# EasyEDA Pro project 51.eprj

# Schematic Schematic1
Board Name: Board1; Create Date: 2025-02-16; Page Name: P1; Project Name: 51; Schematic Name: Schematic1; Update Date: 2025-02-23; Company: 嘉立创EDA; Page Size: A4; Version: V1.0
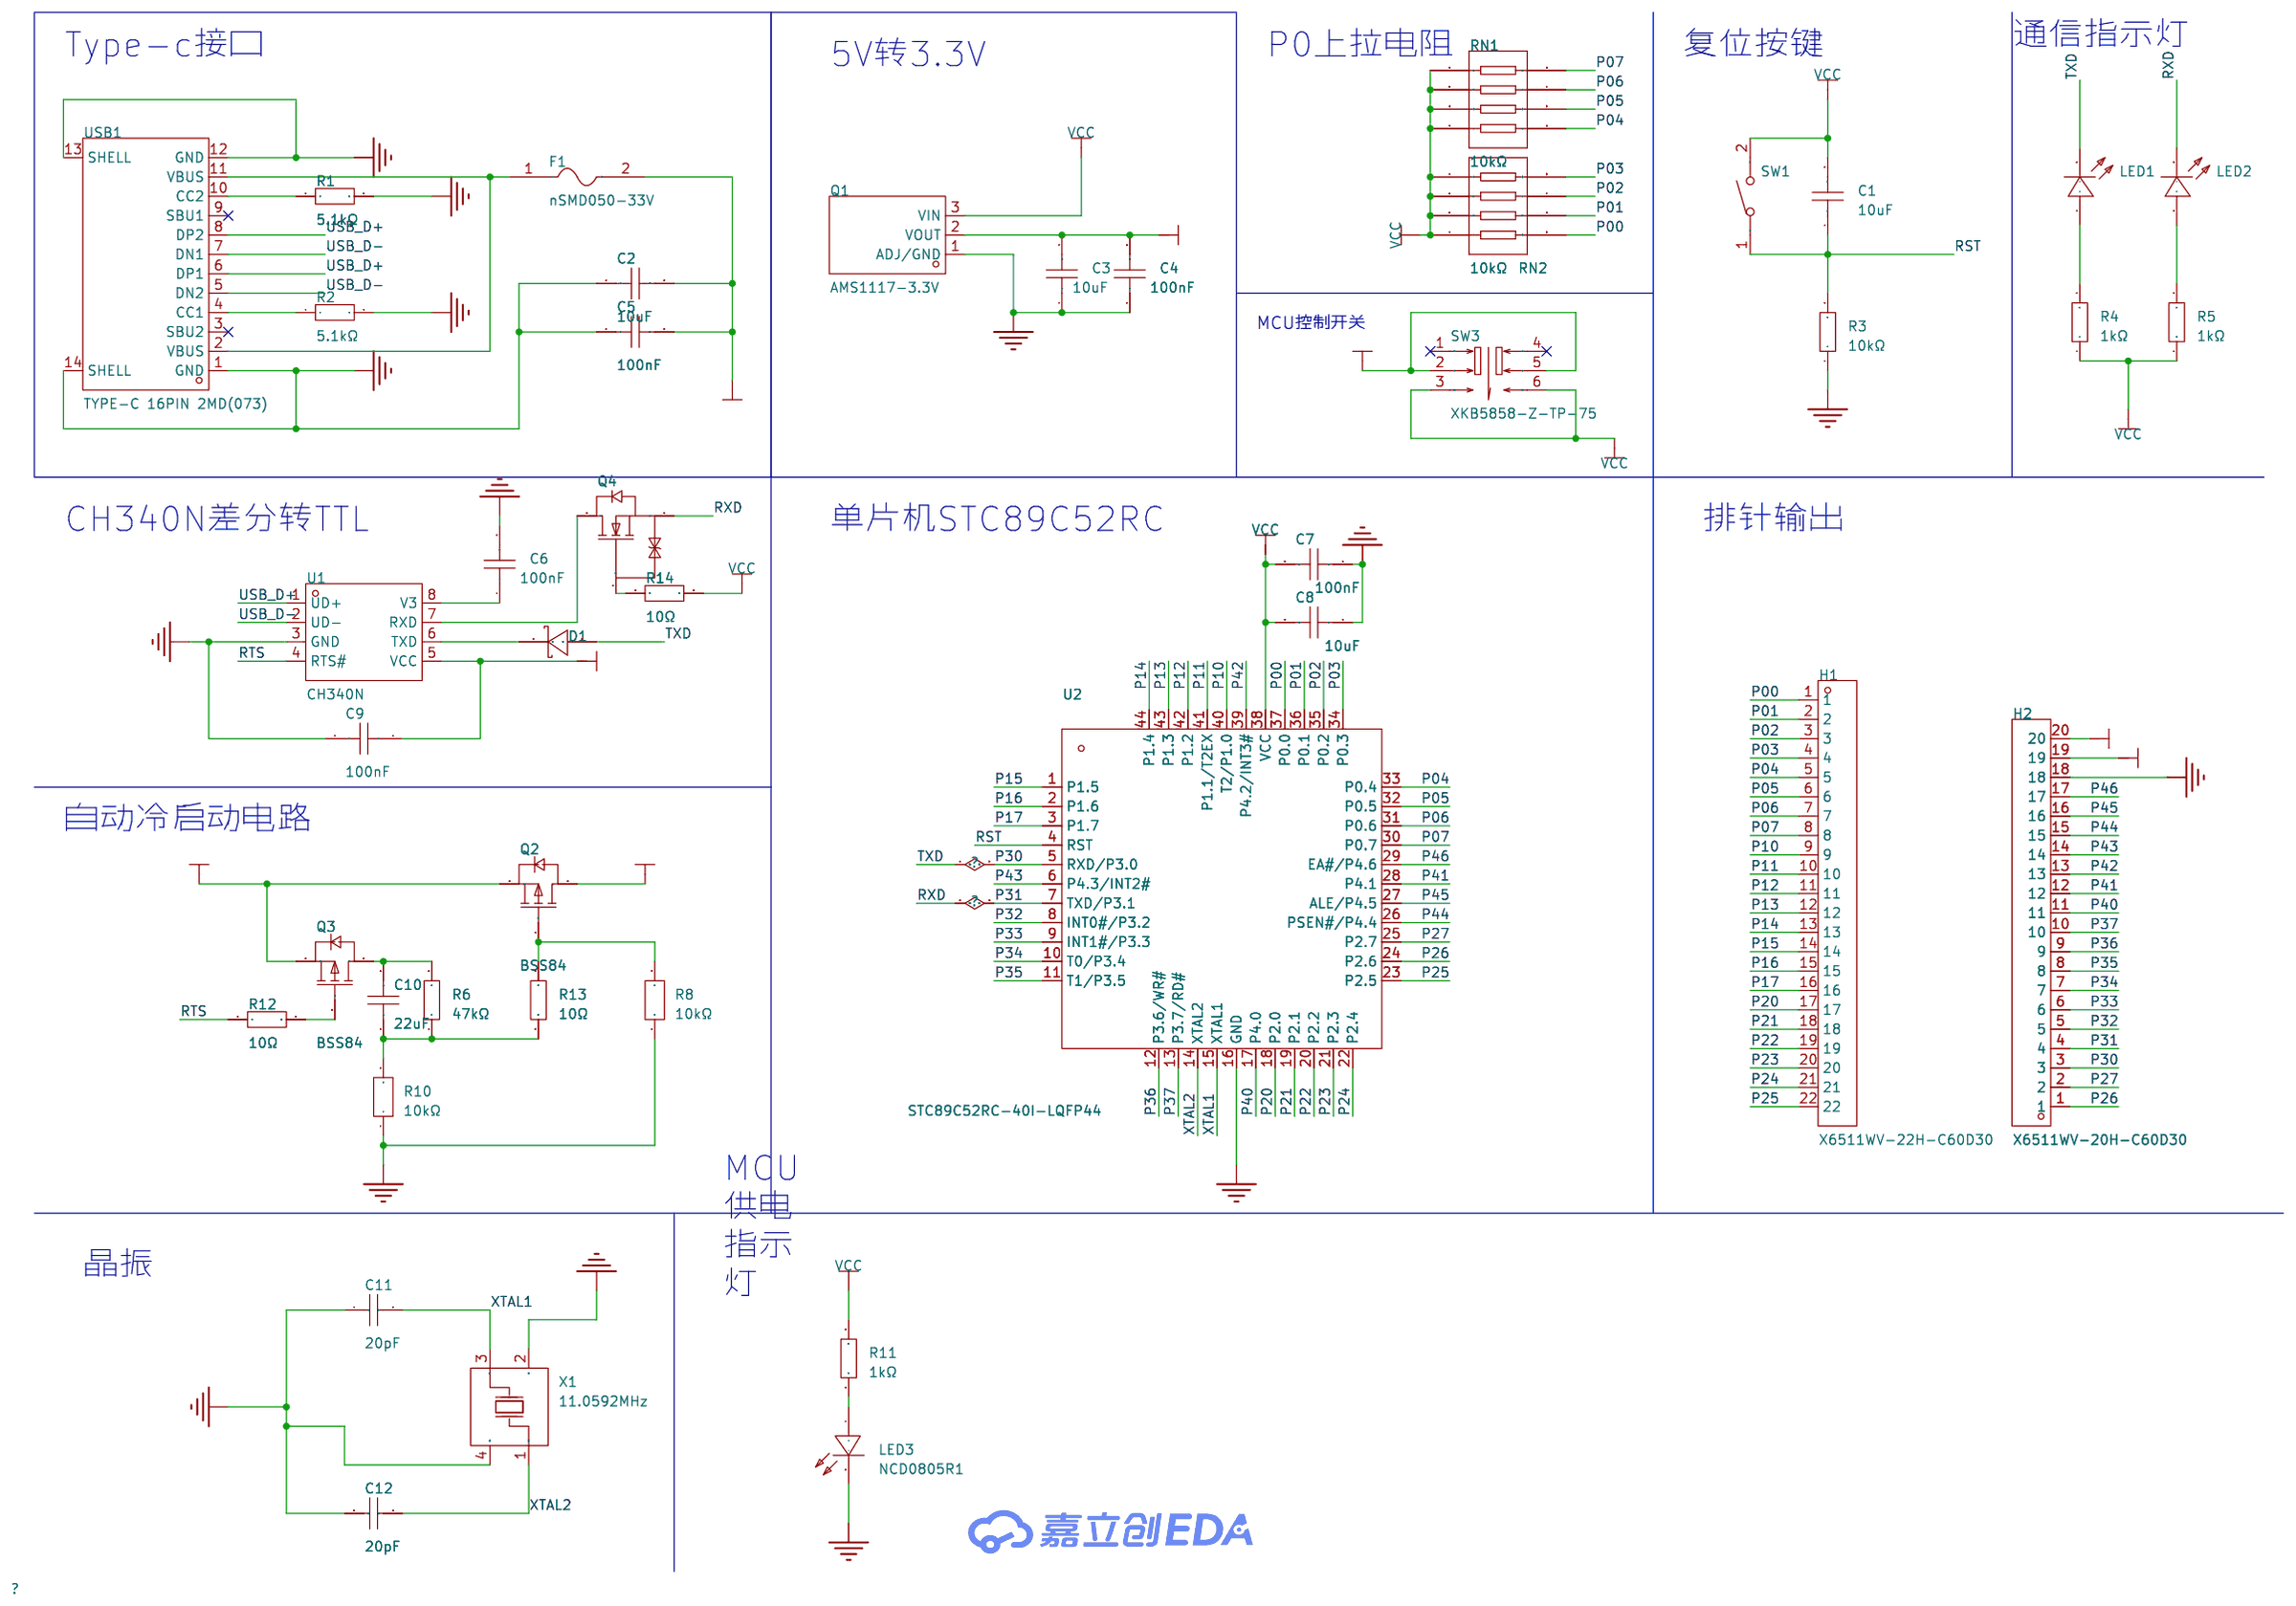
[diagram p0: schematic sheet]

## Parts
C1  10uF  [C0603]
C2  10uF  [C0603]
C3  10uF  [C0603]
C4  100nF  [C0603]
C5  100nF  [C0603]
C6  100nF  [C0603]
C7  100nF  [C0603]
C8  10uF  [C0603]
C9  100nF  [C0603]
C10  22uF  [C0603]
C11  20pF  [C0603]
C12  20pF  [C0603]
D1  B0520W  [SOD-123_L2.6-W1.7-LS3.5-RD]
F1  nSMD050-33V  [F1206]
H1  X6511WV-22H-C60D30  [HDR-TH_22P-P2.54-V-M]
H2  X6511WV-20H-C60D30  [HDR-TH_20P-P2.54-V-M]
LED1  NCD0805R1  [LED0805-R-RD]
LED2  NCD0805R1  [LED0805-R-RD]
LED3  NCD0805R1  [LED0805-R-RD]
Q1  AMS1117-3.3V  [SOT-89-3_L4.5-W2.5-P1.50-LS4.2-BR]
Q2  BSS84  [SOT-23-3_L2.9-W1.3-P1.90-LS2.4-BR-1]
Q3  BSS84  [SOT-23-3_L2.9-W1.3-P1.90-LS2.4-BR-1]
Q4  2SK3018  [SOT-23-3_L2.9-W1.4-P1.90-LS2.6-BR]
R1  5.1kΩ  [R0603]
R2  5.1kΩ  [R0603]
R3  10kΩ  [R0603]
R4  1kΩ  [R0603]
R5  1kΩ  [R0603]
R6  47kΩ  [R0603]
R8  10kΩ  [R0603]
R10  10kΩ  [R0603]
R11  1kΩ  [R0603]
R12  10Ω  [R0603]
R13  10Ω  [R0603]
R14  10Ω  [R0603]
RN1  10kΩ  [RES-ARRAY-SMD_0402-8P-L2.0-W1.0-BL]
RN2  10kΩ  [RES-ARRAY-SMD_0402-8P-L2.0-W1.0-BL]
SW1  TS-1088-AR02016  [SW-SMD_L3.9-W3.0-P4.45]
SW3  XKB5858-Z-TP-75  [SW-SMD_6P-L5.8-W5.8-P2.00-LS8.3]
U1  CH340N  [SOP-8_L4.9-W3.9-P1.27-LS6.0-BL]
U2  STC89C52RC-40I-LQFP44  [LQFP-44_L10.0-W10.0-P0.80-LS12.0-BL]
USB1  TYPE-C 16PIN 2MD(073)  [USB-C-SMD_TYPE-C-6PIN-2MD-073]
X1  11.0592MHz  [CRYSTAL-SMD_4P-L5.0-W3.2-BL]

## Library data of the parts
C1-C3 C8 = CGA0603X5R106K100JT: LCSC Part Name: 10uF ±10% 10V; Supplier Part: C6119842; Manufacturer: HRE(芯声); Supplier Footprint: 0603; JLCPCB Part Class: 扩展库; Supplier: LCSC; Tolerance: ±10%; Voltage Rated: 10V; Temperature Coefficient: X5R
C4-C7 C9 = CGA0603X7R104K500JT: LCSC Part Name: 100nF ±10% 50V; Supplier Part: C6119867; Manufacturer: HRE(芯声); Supplier Footprint: 0603; JLCPCB Part Class: 扩展库; Supplier: LCSC; Tolerance: ±10%; Voltage Rated: 50V; Temperature Coefficient: X7R
C10 = CGA0603X5R226M160JT: LCSC Part Name: 22uF ±20% 16V; Supplier Part: C6119868; Manufacturer: HRE(芯声); Supplier Footprint: 0603; JLCPCB Part Class: 扩展库; Supplier: LCSC; Tolerance: ±20%; Voltage Rated: 16V; Temperature Coefficient: X5R
C11 C12 = CL10C200JB8NNNC: LCSC Part Name: 20pF ±5% 50V; Supplier Part: C1648; Manufacturer: SAMSUNG(三星); Supplier Footprint: 0603; JLCPCB Part Class: 基础库; Datasheet: https://atta.szlcsc.com/upload/public/pdf/source/20160218/1457707763339.pdf; Supplier: LCSC; Tolerance: ±5%; Voltage Rated: 50V; Temperature Coefficient: C0G
D1 = B0520W_C5189256: LCSC Part Name: 电压:20V 电流:500mA; Supplier Part: C5189256; Manufacturer: TWGMC(台湾迪嘉); Supplier Footprint: SOD-123; JLCPCB Part Class: 扩展库; Datasheet: https://atta.szlcsc.com/upload/public/pdf/source/20221012/F0D1432D6590E003997B40C6325B554B.pdf; Supplier: LCSC; Diode Configuration: 独立式; Forward Voltage (Vf@If): 430mV@500mA; Reverse Voltage (Vr): 20V; Rectified Current: 500mA; Reverse Leakage Current (Ir): 250uA
F1 = nSMD050-33V: LCSC Part Name: 0.50A  33V 自恢复保险丝; Supplier Part: C70077; Manufacturer: 台湾陆海; Supplier Footprint: 1206; JLCPCB Part Class: 扩展库; Datasheet: https://atta.szlcsc.com/upload/public/pdf/source/20180608/C70077_B8D50CC58F6AC16481F48F7D0521DF66.pdf; Supplier: LCSC; Operating Voltage (Max): 33V; Current Rating (Max): 100A; Hold Current: 500mA; Trip Current: 1A
H1 = X6511WV-22H-C60D30: LCSC Part Name: 1x22P 间距:2.54mm 方针; Supplier Part: C725954; Manufacturer: XKB Connection(中国星坤); Supplier Footprint: 插件,P=2.54mm; JLCPCB Part Class: 扩展库; Datasheet: https://atta.szlcsc.com/upload/public/pdf/source/20221108/2FDDF9C694C8EDC81165E23F2EAAE597.pdf; Supplier: LCSC; Pin Structure: 1x22P; Pitch: 2.54mm; Row Spacing: 2.54mm; Circluar Pins/Square Pins: 方针; Number of Rows: 单排; Number of Pins: 22P; Current Rating (Max): 3A; Voltage Rating (Max): 250V; Insulation Height: 2.5mm; Contact Material: 黄铜; Contact Plating: 金; Operating Temperature Range: -40℃~+105℃; Soldering Temperature(Max): 260℃; Color: 黑色
H2 = X6511WV-20H-C60D30: LCSC Part Name: 1x20P 间距:2.54mm 方针; Supplier Part: C725952; Manufacturer: XKB Connection(中国星坤); Supplier Footprint: 插件,P=2.54mm; JLCPCB Part Class: 扩展库; Datasheet: https://atta.szlcsc.com/upload/public/pdf/source/20221108/2FDDF9C694C8EDC81165E23F2EAAE597.pdf; Supplier: LCSC; Pin Structure: 1x20P; Pitch: 2.54mm; Row Spacing: 2.54mm; Circluar Pins/Square Pins: 方针; Number of Rows: 单排; Number of Pins: 20P; Current Rating (Max): 3A; Voltage Rating (Max): 250V; Insulation Height: 2.5mm; Contact Material: 黄铜; Contact Plating: 金; Operating Temperature Range: -40℃~+105℃; Soldering Temperature(Max): 260℃; Color: 黑色
LED1-LED3 = NCD0805R1: Supplier Part: C84256; Manufacturer: 国星光电; Supplier Footprint: 0805; JLCPCB Part Class: 基础库; Datasheet: https://atta.szlcsc.com/upload/public/pdf/source/20200820/C84256_F0A75A43B3EAD75808600A0514C76B99.pdf; Supplier: LCSC; Emitted Color: 红色; Forward Voltage (VF): 1.6V~2.6V; Power Dissipation: 65mW; Forward Current: 20mA; Dominant Wavelength: 615nm~630nm; Diode Configuration: 独立二极管; Lens Color: 无色透明透镜; Luminous Intensity: 67mcd~195mcd; Viewing Angle: 130°; Operating Temperature: -30℃~+85℃
Q1 = AMS1117-3.3V_C5120796: LCSC Part Name: 输入18V 输出3.3V 1A; Supplier Part: C5120796; Manufacturer: MSKSEMI(美森科); Supplier Footprint: SOT-89; JLCPCB Part Class: 扩展库; Datasheet: https://atta.szlcsc.com/upload/public/pdf/source/20220727/5E62EAC46FFFF83337622C0FBE1B6BF8.pdf; Supplier: LCSC; Output Type: 固定; Maximum Input Voltage: 18V; Output Voltage: 3.3V; MAX Output Current: 1A; Dropout Voltage: 1.4V@(1A); standby current: 12mA; Operating Temperature: 0℃~+125℃; Output Polarity: 正极; Number of Outputs: 1
Q2 Q3 = BSS84_C7420340: LCSC Part Name: P沟道,电流:-0.17A,耐压:-60V; Supplier Part: C7420340; Manufacturer: 宏迦橙; Supplier Footprint: SOT-23; JLCPCB Part Class: 扩展库; Datasheet: https://atta.szlcsc.com/upload/public/pdf/source/20230630/CFCF3EFF80655E4500DCC7BD4B2736C9.pdf; Supplier: LCSC; Type: 1个P沟道; Drain Source Voltage (Vdss): 60V; Continuous Drain Current (Id): 170mA; Drain Source On Resistance (RDS(on)@Vgs,Id): 8Ω@10V,0.17A; Power Dissipation (Pd): 225mW; Gate Threshold Voltage (Vgs(th)@Id): 900mV@250uA; Total Gate Charge (Qg@Vgs): 1.77nC@10V; Input Capacitance (Ciss@Vds): 43pF; Reverse Transfer Capacitance (Crss@Vds): 2.8pF; Operating Temperature: -55℃~+150℃
Q4 = 2SK3018: LCSC Part Name: 1个N沟道 耐压:30V 电流:100mA; Supplier Part: C727148; Manufacturer: TWGMC(台湾迪嘉); Supplier Footprint: SOT-23; JLCPCB Part Class: 扩展库; Datasheet: https://atta.szlcsc.com/upload/public/pdf/source/20200827/C727148_2301BBDB89FCE642A4A39ABEF7075607.pdf; Supplier: LCSC; Type: 1个N沟道; Drain Source Voltage (Vdss): 30V; Continuous Drain Current (Id): 100mA; Drain Source On Resistance (RDS(on)@Vgs,Id): 13Ω@2.5V,1mA; Power Dissipation (Pd): 350mW; Gate Threshold Voltage (Vgs(th)@Id): 800mV@100uA; Input Capacitance (Ciss@Vds): 13pF; Reverse Transfer Capacitance (Crss@Vds): 4pF; Operating Temperature: -55℃~+150℃
R1 R2 = 0603WAF5101T5E: LCSC Part Name: 5.1kΩ ±1% 100mW 厚膜电阻; Supplier Part: C23186; Manufacturer: UNI-ROYAL(厚声); Supplier Footprint: 0603; JLCPCB Part Class: 基础库; Datasheet: https://atta.szlcsc.com/upload/public/pdf/source/20200306/C422600_1E6D84923E4A46A82E41ADD87F860B5C.pdf; Supplier: LCSC; Type: 厚膜电阻; Tolerance: ±1%; Power(Watts): 100mW; Overload Voltage (Max): 75V; Temperature Coefficient: ±100ppm/℃; Operating Temperature Range: -55℃~+155℃
R3 = 0603WAF1002T5E: LCSC Part Name: 厚膜电阻 10kΩ ±1% 100mW; Supplier Part: C25804; Manufacturer: UNI-ROYAL(厚声); Supplier Footprint: 0603; JLCPCB Part Class: 基础库; Datasheet: https://atta.szlcsc.com/upload/public/pdf/source/20200306/C422600_1E6D84923E4A46A82E41ADD87F860B5C.pdf; Supplier: LCSC; Type: 厚膜电阻; Tolerance: ±1%; Power(Watts): 100mW; Overload Voltage (Max): 75V; Temperature Coefficient: ±100ppm/℃; Operating Temperature Range: -55℃~+155℃
R4 R5 R11 = 0603WAF1001T5E: LCSC Part Name: 1kΩ ±1% 100mW 厚膜电阻; Supplier Part: C21190; Manufacturer: UNI-ROYAL(厚声); Supplier Footprint: 0603; JLCPCB Part Class: 基础库; Datasheet: https://atta.szlcsc.com/upload/public/pdf/source/20200306/C422600_1E6D84923E4A46A82E41ADD87F860B5C.pdf; Supplier: LCSC; Type: 厚膜电阻; Tolerance: ±1%; Power(Watts): 100mW; Overload Voltage (Max): 75V; Temperature Coefficient: ±100ppm/℃; Operating Temperature Range: -55℃~+155℃
R6 = 0603WAF4702T5E: LCSC Part Name: 47kΩ ±1% 100mW 厚膜电阻; Supplier Part: C25819; Manufacturer: UNI-ROYAL(厚声); Supplier Footprint: 0603; JLCPCB Part Class: 基础库; Datasheet: https://atta.szlcsc.com/upload/public/pdf/source/20200306/C422600_1E6D84923E4A46A82E41ADD87F860B5C.pdf; Supplier: LCSC; Type: 厚膜电阻; Tolerance: ±1%; Power(Watts): 100mW; Overload Voltage (Max): 75V; Temperature Coefficient: ±100ppm/℃; Operating Temperature Range: -55℃~+155℃
R8 R10 = FRC0603J103TS: LCSC Part Name: 10kΩ ±5% 100mW 厚膜电阻; Supplier Part: C2930027; Manufacturer: FOJAN(富捷); Supplier Footprint: 0603; JLCPCB Part Class: 扩展库; Datasheet: https://atta.szlcsc.com/upload/public/pdf/source/20211221/925EC7D7225764EE0046F22065062C87.pdf; Supplier: LCSC; Type: 厚膜电阻; Tolerance: ±5%; Power(Watts): 100mW; Overload Voltage (Max): 75V; Temperature Coefficient: ±100ppm/℃; Operating Temperature Range: -55℃~+155℃
R12-R14 = 0603WAF100JT5E: LCSC Part Name: 10Ω ±1% 100mW 厚膜电阻; Supplier Part: C22859; Manufacturer: UNI-ROYAL(厚声); Supplier Footprint: 0603; JLCPCB Part Class: 基础库; Datasheet: https://atta.szlcsc.com/upload/public/pdf/source/20200306/C422600_1E6D84923E4A46A82E41ADD87F860B5C.pdf; Supplier: LCSC; Type: 厚膜电阻; Tolerance: ±1%; Power(Watts): 100mW; Overload Voltage (Max): 75V; Temperature Coefficient: ±400ppm/℃; Operating Temperature Range: -55℃~+155℃
RN1 RN2 = 4D02WGJ0103TCE: LCSC Part Name: 10kΩ ±5%; Supplier Part: C25725; Manufacturer: UNI-ROYAL(厚声); Supplier Footprint: 0402x4; JLCPCB Part Class: 扩展库; Datasheet: https://atta.szlcsc.com/upload/public/pdf/source/20191224/C474318_2527498AE30E813171187CCD28401A71.pdf; Supplier: LCSC; Number of Resistors: 4; Tolerance: ±5%; Power(Watts): 62.5mW; Temperature Coefficient: ±200ppm/℃; Number of Pins: 8
SW1 = TS-1088-AR02016: LCSC Part Name: 4*3*2mm 立贴 轻触开关; Supplier Part: C720477; Manufacturer: XUNPU(讯普); Supplier Footprint: SMD; JLCPCB Part Class: 扩展库; Datasheet: https://atta.szlcsc.com/upload/public/pdf/source/20200810/C720475_60D09DD6C54279ADDB2DC25100F1CC11.pdf; Supplier: LCSC; Circuit: 单刀单掷; Actuator Style: 圆形按钮; Operating Force: 160gf; Mounting Style: 立贴; Switch Length: 4mm; Switch Width: 3mm; Switch Height: 2mm; Strike Gundam: 不带; Contact Current: 50mA; Voltage Rating (DC): 12V; Insulation Resistance: 100MΩ; Actuator/Cap Color: 黑色; Pin Style: SMD接片; Mechanical Life: 10万次; Operating Temperature: -30℃~+80℃
SW3 = XKB5858-Z-TP-75: LCSC Part Name: 按键开关5.8*按键开关5.8贴片自锁开关 平头; Supplier Part: C692487; Manufacturer: XKB Connectivity(中国星坤); Supplier Footprint: SMD; JLCPCB Part Class: 扩展库; Datasheet: https://atta.szlcsc.com/upload/public/pdf/source/20211011/C026329EEDA5FA5907D52CCCFB7A027C.pdf; Supplier: LCSC; Self Lock / No Lock: 自锁; Actuator Style: 方形按钮; Mounting Style: 立贴; Contact Current: 100mA; Voltage Rating (AC): 250V; Voltage Rating (DC): 30V; Insulation Resistance: 100MΩ; Actuator/Cap Color: 白色; With Lamp: 不带; Pin Style: SMD接片; Operating Force: 160gf; Operating Temperature: -15℃~+55℃; Mechanical Life: 10万次
U1 = CH340N: LCSC Part Name: USB转串口芯片CH340; Supplier Part: C2977777; Manufacturer: WCH(南京沁恒); Supplier Footprint: SOP-8; JLCPCB Part Class: 扩展库; Datasheet: https://atta.szlcsc.com/upload/public/pdf/source/20240313/115CDE92081B1D6CB446704AD5D0F5F2.pdf; Supplier: LCSC; Applications Function: USB转串口; Protocol: USB 2.0; Number of Channels: 1; Supply Voltage: 3.3V；5V; Data Rate: 2Mbps; Operating Temperature: -20℃~+70℃
U2 = STC89C52RC-40I-LQFP44: Supplier Part: C8707; Manufacturer: STC; Supplier Footprint: LQFP-44(10x10); JLCPCB Part Class: 扩展库; Datasheet: https://atta.szlcsc.com/upload/public/pdf/source/20241226/242305099CBBF4767F79975207B2F263.pdf; Supplier: LCSC; CPU Core: 51系列; Program Storage Size: 8KB; Program Memory Type: FLASH; Number of I/O: 39; Low Voltage Detection Threshold: 3.3V~5.5V
USB1 = TYPE-C 16PIN 2MD(073): LCSC Part Name: Type-C 母 卧贴; Supplier Part: C2765186; Manufacturer: SHOU HAN(首韩); Supplier Footprint: SMD; JLCPCB Part Class: 扩展库; Datasheet: https://atta.szlcsc.com/upload/public/pdf/source/20211123/39B17C16241EAC15C5E277BDA434118E.pdf; Supplier: LCSC; Connector Type: Type-C; Standard: USB 3.1; Gender: 母; Mounting Style: 卧贴; Number of Contacts: 16P; Number of Ports: 1; Current Rating - Power (Max): 5A; Operating Temperature Range: -25℃~+85℃; Rated Voltage (Max): 5V; Connect-Disconnect Life: 5千次; Core Colour: 黑色
X1 = TXM11.059M0004503LDCDO00T: LCSC Part Name: 11.0592MHz ±20ppm 20pF; Supplier Part: C362357; Manufacturer: YJX(雅晶鑫); Supplier Footprint: SMD5032-4P; JLCPCB Part Class: 扩展库; Datasheet: https://atta.szlcsc.com/upload/public/pdf/source/20190124/C362357_79AA44C3BCE26F730BD469CF609EF204.pdf; Supplier: LCSC; Crystal Type: 贴片晶振; Normal temperature Frequency Tolerance: ±20ppm; External load capacitor: 20pF; Frequency Stability(Full temperature range): ±20ppm; Equivalent Series Resistance (ESR): 80Ω; Operating Temperature: -40℃~+85℃

## Nets
3V3: C3.2 C4.2 H2.19 Q1.2(VOUT)
GND: C2.1 C3.1 C4.1 C5.1 C6.2 C7.1 C8.1 C9.2 C11.1 C12.1 H2.18 LED3.2(-) Q1.1(ADJ/GND) R1.2 R2.2 R3.1 R8.1 R10.1 U1.3(GND) U2.16(GND) USB1.1(GND) USB1.12(GND) USB1.13(SHELL) USB1.14(SHELL) X1.2(GND) X1.4(GND)
VCC: C1.2 C7.2 C8.2 H2.20 Q1.3(VIN) R4.1 R5.1 R11.2 R14.2 RN1.1 RN1.2 RN1.3 RN1.4 RN2.1 RN2.2 RN2.3 RN2.4 SW1.2 SW3.3 SW3.6 U2.38(VCC)
VCC_SW: Q2.3(D) SW3.2 SW3.5
VIN_5V: C2.2 C5.2 C9.1 F1.2 Q2.2(S) Q3.2(S) U1.5(VCC)
P00: H1.1 RN2.5 U2.37(P0.0)
P01: H1.2 RN2.6 U2.36(P0.1)
P02: H1.3 RN2.7 U2.35(P0.2)
P03: H1.4 RN2.8 U2.34(P0.3)
P04: H1.5 RN1.5 U2.33(P0.4)
P05: H1.6 RN1.6 U2.32(P0.5)
P06: H1.7 RN1.7 U2.31(P0.6)
P07: H1.8 RN1.8 U2.30(P0.7)
P10: H1.9 U2.40(T2/P1.0)
P11: H1.10 U2.41(P1.1/T2EX)
P12: H1.11 U2.42(P1.2)
P13: H1.12 U2.43(P1.3)
P14: H1.13 U2.44(P1.4)
P15: H1.14 U2.1(P1.5)
P16: H1.15 U2.2(P1.6)
P17: H1.16 U2.3(P1.7)
P20: H1.17 U2.18(P2.0)
P21: H1.18 U2.19(P2.1)
P22: H1.19 U2.20(P2.2)
P23: H1.20 U2.21(P2.3)
P24: H1.21 U2.22(P2.4)
P25: H1.22 U2.23(P2.5)
P26: H2.1 U2.24(P2.6)
P27: H2.2 U2.25(P2.7)
P30: D1.2 H2.3 LED1.2(-) U2.5(RXD/P3.0)
P31: H2.4 LED2.2(-) Q4.2(S) U2.7(TXD/P3.1)
P32: H2.5 U2.8(INT0#/P3.2)
P33: H2.6 U2.9(INT1#/P3.3)
P34: H2.7 U2.10(T0/P3.4)
P35: H2.8 U2.11(T1/P3.5)
P36: H2.9 U2.12(P3.6/WR#)
P37: H2.10 U2.13(P3.7/RD#)
P40: H2.11 U2.17(P4.0)
P41: H2.12 U2.28(P4.1)
P42: H2.13 U2.39(P4.2/INT3#)
P43: H2.14 U2.6(P4.3/INT2#)
P44: H2.15 U2.26(PSEN#/P4.4)
P45: H2.16 U2.27(ALE/P4.5)
P46: H2.17 U2.29(EA#/P4.6)
RST: C1.1 R3.2 SW1.1 U2.4(RST)
RTS: R12.1 U1.4(RTS#)
USB_D+: U1.1(UD+) USB1.6(DP1) USB1.8(DP2)
USB_D-: U1.2(UD-) USB1.5(DN2) USB1.7(DN1)
XTAL1: C11.2 U2.15(XTAL1) X1.3(OSC2)
XTAL2: C12.2 U2.14(XTAL2) X1.1(OSC1)
$1N493: R1.1 USB1.10(CC2)
$1N513: R2.1 USB1.4(CC1)
$1N622: F1.1 USB1.2(VBUS) USB1.11(VBUS)
$1N5316: LED3.1(+) R11.1
$1N5569: C6.1 U1.8(V3)
$1N5583: Q4.3(D) U1.7(RXD)
$1N5587: D1.1 U1.6(TXD)
$1N5943: LED1.1(+) R4.2
$1N5953: LED2.1(+) R5.2
$1N7938: Q3.1(G) R12.2
$1N8027: C10.2 Q3.3(D) R6.2
$1N8039: C10.1 R6.1 R10.2 R13.1
$1N8088: Q2.1(G) R8.2 R13.2
$1N12588: Q4.1(G) R14.1

Not connected (* = marked no-connect by the designer): SW3 1* 4*; USB1 3(SBU2)* 9(SBU1)*

## Notes on the sheet
- Type-c接口
- P0上拉电阻
- 复位按键
- 通信指示灯
- 5V转3.3V
- MCU控制开关
- CH340N差分转TTL
- 单片机STC89C52RC
- 排针输出
- 自动冷启动电路
- 晶振
- MCU
  供电
  指示
  灯

# Board PCB1
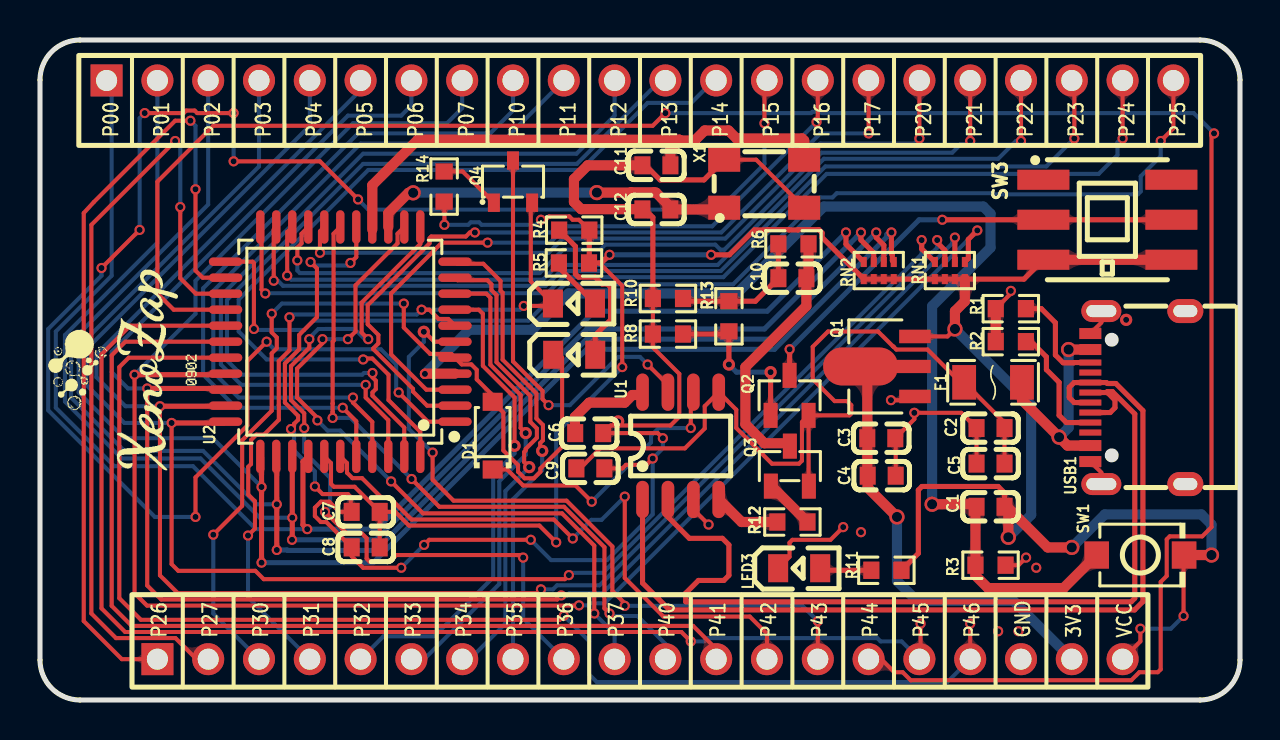
[diagram p1: board, top side]
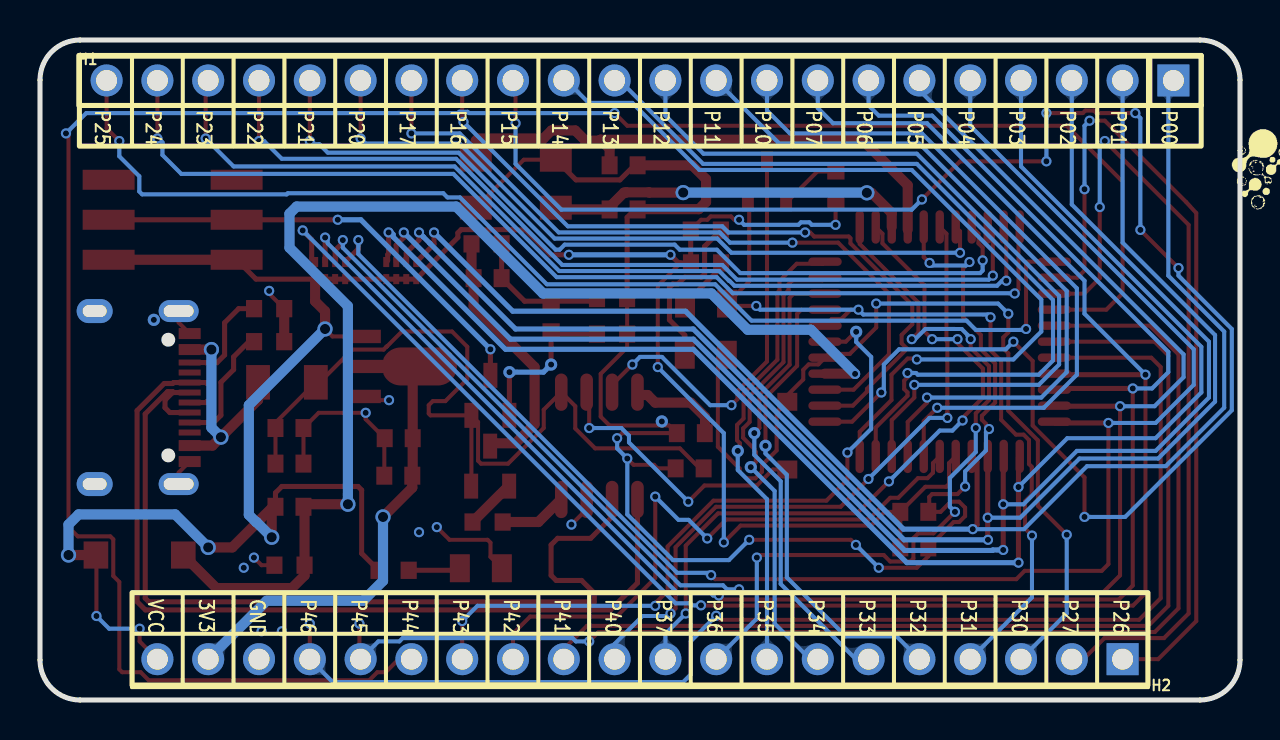
[diagram p2: board, bottom side, seen from below]

Outline 60 x 33 mm; copper layers: Top Layer, Bottom Layer. Coordinates in mm from the lower left corner of the outline.
Outline path: 0,31 0,2 arc(0.59,0.59) 2,0 58,0 arc(59.41,0.59) 60,2 60,31 arc(59.41,32.41) 58,33 2,33 arc(0.59,32.41) 0,31
Stack: Top Layer 0.035mm / Dielectric1 1.51mm FR4 er 4.5 / Bottom Layer 0.035mm

## Design rules (mm)
net USB_D+: DP1
net USB_D-: DP1
template: 自定义配置
spacing copperThickness1oz (default): track to track 0.102, other pairs 0.152 to 0.3
spacing copperThickness2oz: track to track 0.203, other pairs 0.152 to 0.3
track width copperThickness1oz (default): min 0.127, default 0.254, max 2.54
track width copperThickness2oz: min 0.203, default 0.254, max 2.54
differential pair differentialPair (default): width min 0.127, default 0.254, max 2.54; gap min 0.152, default 0.152
via viaSize (default): diameter min 0.5, default 0.61, max 10; hole min 0.3, default 0.305, max 6.3

## Placement (name value [footprint] x y rotation side)
C1  10uF  [C0603]  47.53 9.66 0 top
C2  10uF  [C0603]  47.53 13.6 0 top
C3  10uF  [C0603]  42.06 13.09 180 top
C4  100nF  [C0603]  42.08 11.22 180 top
C5  100nF  [C0603]  47.53 11.82 0 top
C6  100nF  [C0603]  27.46 13.34 0 top
C7  100nF  [C0603]  16.28 9.41 0 top
C8  10uF  [C0603]  16.28 7.63 0 top
C9  100nF  [C0603]  27.52 11.58 0 top
C10  22uF  [C0603]  37.62 21.09 0 top
C11  20pF  [C0603]  30.82 26.73 0 top
C12  20pF  [C0603]  30.82 24.53 0 top
D1  B0520W  [SOD-123_L2.6-W1.7-LS3.5-RD]  22.63 13.22 90 top
F1  nSMD050-33V  [F1206]  47.65 15.88 180 top
H1  X6511WV-22H-C60D30  [HDR-TH_22P-P2.54-V-M]  30 30.98 0 bottom
H2  X6511WV-20H-C60D30  [HDR-TH_20P-P2.54-V-M]  30 2.04 0 bottom
LED1  NCD0805R1  [LED0805-R-RD]  26.71 17.26 0 top
LED2  NCD0805R1  [LED0805-R-RD]  26.7 19.82 0 top
LED3  NCD0805R1  [LED0805-R-RD]  37.96 6.59 0 top
Q1  AMS1117-3.3V  [SOT-89-3_L4.5-W2.5-P1.50-LS4.2-BR]  42.39 16.68 0 top
Q2  BSS84  [SOT-23-3_L2.9-W1.3-P1.90-LS2.4-BR-1]  37.48 15.23 270 top
Q3  BSS84  [SOT-23-3_L2.9-W1.3-P1.90-LS2.4-BR-1]  37.49 11.69 270 top
Q4  2SK3018  [SOT-23-3_L2.9-W1.4-P1.90-LS2.6-BR]  23.65 25.92 270 top
R1  5.1kΩ  [R0603]  48.54 19.57 180 top
R2  5.1kΩ  [R0603]  48.54 17.92 180 top
R3  10kΩ  [R0603]  47.53 6.74 180 top
R4  1kΩ  [R0603]  26.71 23.49 180 top
R5  1kΩ  [R0603]  26.7 21.85 180 top
R6  47kΩ  [R0603]  37.67 22.81 0 top
R8  10kΩ  [R0603]  31.4 18.3 0 top
R10  10kΩ  [R0603]  31.4 20.08 0 top
R11  1kΩ  [R0603]  42.32 6.49 0 top
R12  10Ω  [R0603]  37.62 8.9 0 top
R13  10Ω  [R0603]  34.44 19.19 270 top
R14  10Ω  [R0603]  20.21 25.67 270 top
RN1  10kΩ  [RES-ARRAY-SMD_0402-8P-L2.0-W1.0-BL]  45.49 21.47 180 top
RN2  10kΩ  [RES-ARRAY-SMD_0402-8P-L2.0-W1.0-BL]  41.94 21.47 180 top
SW1  TS-1088-AR02016  [SW-SMD_L3.9-W3.0-P4.45]  55.02 7.25 0 top
SW3  XKB5858-Z-TP-75  [SW-SMD_6P-L5.8-W5.8-P2.00-LS8.3]  53.37 24.01 0 top
U1  CH340N  [SOP-8_L4.9-W3.9-P1.27-LS6.0-BL]  32.03 12.71 0 top
U2  STC89C52RC-40I-LQFP44  [LQFP-44_L10.0-W10.0-P0.80-LS12.0-BL]  15.01 17.92 90 top
USB1  TYPE-C 16PIN 2MD(073)  [USB-C-SMD_TYPE-C-6PIN-2MD-073]  54.89 15.12 90 top
X1  11.0592MHz  [CRYSTAL-SMD_4P-L5.0-W3.2-BL]  36.21 25.81 0 top

## Footprints (pads in the part's own frame, mm; a bottom-side part is the same pattern mirrored in y, then rotated)
C0603
  rect 0.8x0.9 smd: 1(-0.7,0) 2(0.7,0)
CRYSTAL-SMD_4P-L5.0-W3.2-BL
  rect 1.6x1.2 smd: 1(-2,-1.2) 2(2,-1.2) 3(2,1.2) 4(-2,1.2)
F1206
  rect 1.19x1.728 smd: 1(-1.445,0) 2(1.445,0)
HDR-TH_20P-P2.54-V-M
  rect 1.6x1.6 hole 1.05: 1(-24.13,0)
  round 1.6 hole 1.05: 2(-21.59,0) 3(-19.05,0) 4(-16.51,0) 5(-13.97,0) 6(-11.43,0) 7(-8.89,0) 8(-6.35,0) 9(-3.81,0) 10(-1.27,0) 11(1.27,0) 12(3.81,0) 13(6.35,0) 14(8.89,0) 15(11.43,0) 16(13.97,0) 17(16.51,0) 18(19.05,0) 19(21.59,0) 20(24.13,0)
HDR-TH_22P-P2.54-V-M
  rect 1.6x1.6 hole 1.05: 1(-26.67,0)
  round 1.6 hole 1.05: 2(-24.13,0) 3(-21.59,0) 4(-19.05,0) 5(-16.51,0) 6(-13.97,0) 7(-11.43,0) 8(-8.89,0) 9(-6.35,0) 10(-3.81,0) 11(-1.27,0) 12(1.27,0) 13(3.81,0) 14(6.35,0) 15(8.89,0) 16(11.43,0) 17(13.97,0) 18(16.51,0) 19(19.05,0) 20(21.59,0) 21(24.13,0) 22(26.67,0)
LED0805-R-RD
  rect 1x1.399 smd: 1(1.05,0) 2(-1.05,0)
LQFP-44_L10.0-W10.0-P0.80-LS12.0-BL
  oval 0.42x1.67 smd: 1(-4,-5.735) 2(-3.2,-5.735) 3(-2.4,-5.735) 4(-1.6,-5.735) 5(-0.8,-5.735) 6(0,-5.735) 7(0.8,-5.735) 8(1.6,-5.735) 9(2.4,-5.735) 10(3.2,-5.735) 11(4,-5.735) 23(4,5.735) 24(3.2,5.735) 25(2.4,5.735) 26(1.6,5.735) 27(0.8,5.735) 28(0,5.735) 29(-0.8,5.735) 30(-1.6,5.735) 31(-2.4,5.735) 32(-3.2,5.735) 33(-4,5.735)
  oval 1.67x0.42 smd: 12(5.735,-4) 13(5.735,-3.2) 14(5.735,-2.4) 15(5.735,-1.6) 16(5.735,-0.8) 17(5.735,0) 18(5.735,0.8) 19(5.735,1.6) 20(5.735,2.4) 21(5.735,3.2) 22(5.735,4) 34(-5.735,4) 35(-5.735,3.2) 36(-5.735,2.4) 37(-5.735,1.6) 38(-5.735,0.8) 39(-5.735,0) 40(-5.735,-0.8) 41(-5.735,-1.6) 42(-5.735,-2.4) 43(-5.735,-3.2) 44(-5.735,-4)
R0603
  rect 0.806x0.864 smd: 1(-0.753,0) 2(0.753,0)
RES-ARRAY-SMD_0402-8P-L2.0-W1.0-BL
  rect 0.3x0.505 smd: 1(-0.75,0.427) 2(-0.25,0.427) 3(0.25,0.427) 4(0.75,0.427) 5(0.75,-0.427) 6(0.25,-0.427) 7(-0.25,-0.427) 8(-0.75,-0.427)
SOD-123_L2.6-W1.7-LS3.5-RD
  rect 0.9x1 smd: 1(-1.692,0) 2(1.692,0)
SOP-8_L4.9-W3.9-P1.27-LS6.0-BL
  oval 0.63x1.865 smd: 1(-1.905,-2.683) 2(-0.635,-2.683) 3(0.635,-2.683) 4(1.905,-2.683) 5(1.905,2.683) 6(0.635,2.683) 7(-0.635,2.683) 8(-1.905,2.683)
SOT-23-3_L2.9-W1.3-P1.90-LS2.4-BR-1
  rect 1.25x0.7 smd: 1(1,-0.95) 2(1,0.95) 3(-1,0)
SOT-23-3_L2.9-W1.4-P1.90-LS2.6-BR
  rect 0.91x0.6 smd: 1(1.055,-0.955) 2(1.055,0.955) 3(-1.055,0)
SOT-89-3_L4.5-W2.5-P1.50-LS4.2-BR
  rect 1.575x0.672 smd: 1(1.356,-1.5) 3(1.356,1.5)
  custom 5.377x1.9 smd: 2(-1.356,0)
SW-SMD_6P-L5.8-W5.8-P2.00-LS8.3
  rect 2.6x1 smd: 1(-3.2,2) 2(-3.2,0) 3(-3.2,-2) 4(3.2,2) 5(3.2,0) 6(3.2,-2)
SW-SMD_L3.9-W3.0-P4.45
  rect 1.23x1.36 smd: 1(-2.185,0) 2(2.185,0)
USB-C-SMD_TYPE-C-6PIN-2MD-073
  rect 0.55x1.1 smd: 1(-3.2,2.375) 2(-2.4,2.375) 11(2.4,2.375) 12(3.2,2.375)
  rect 0.3x1.1 smd: 3(-1.75,2.375) 4(-1.25,2.375) 5(-0.75,2.375) 6(-0.25,2.375) 7(0.25,2.375) 8(0.75,2.375) 9(1.25,2.375) 10(1.75,2.375)
  oval 1.1x2 hole 0.6x1.5: 13(-4.325,1.825) 14(4.325,1.825)
  oval 1.2x1.8 hole 0.6x1.2: 13(-4.325,-2.375) 14(4.325,-2.375)

## Nets
As in the schematic.

Pads without a net: SW3 1 4; USB1 3 9

## Via types
v1: diameter 0.508, hole 0.305, Top Layer to Bottom Layer, 123 vias
v2: diameter 0.762, hole 0.508, Top Layer to Bottom Layer, 10 vias
v3: diameter 0.61, hole 0.305, Top Layer to Bottom Layer, 9 vias

## Routing (per net, layer and track width the routed paths; a pad name or vN(x,y) marks a point on that pad's centre or on a via; arc(x,y) is an arc through that point)
3V3: length 21.8
  Top Layer w0.508: 41.03,16.68 41.37,16.35 C3.2 41.37,11.23 C4.2 41.38,10.62 v2(42.85,9.15)
  Bottom Layer w0.508: v2(42.85,9.15) 42.85,5.96 43.84,4.96 48.67,4.96 H2.19
GND: length 108.6
  Top Layer w0.203: v1(15.52,21.85) 15.81,22.14 U2.16 ; R3.1 48.92,6.74 v1(49.3,7.12) ; USB1.1 53.07,11.37 USB1.13 ; v1(13.74,10.68) 14.12,10.3 15.39,10.3 15.54,10.15 15.54,9.45 C7.1 14.97,9.41 14.46,9.91 14.04,9.91 13.74,9.62 13.74,9.2 14.04,8.9 14.31,8.9 C8.1 15.58,7.19 16.16,6.61 v1(18.06,6.61) ; v1(30.63,12.07) 30.32,11.76 29.3,11.76 29.12,11.58 C9.2 ; v1(13.53,21.9) 13.85,21.58 13.85,19.14 12.96,18.25 12.96,17.54 12.24,16.82 12.24,14.87 12.91,14.21 12.91,14.01 12.7,13.81 12.7,13.7 v1(12.55,13.55) ; v1(19.2,7.76) 19.46,8.01 v1(24.54,8.01) ; USB1.12 53.07,18.87 USB1.14 ; 31.02,13.22 30.89,13.34 C6.2 28.54,13.72 31.52,13.72 31.97,14.17 31.97,16.31 30.64,17.63 R8.1 R10.1 ; U1.3 32.67,9.53 v1(33.43,8.77) ; v1(42.55,14.99) 43.56,14.99 Q1.1 ; R1.2 48.54,20.32 v1(48.54,20.46) ; LED3.2 37.48,7.16 37.48,7.87 37.62,8.01 39.53,8.01 v1(40.16,8.64) ; C5.1 C2.1 46.06,14.36 v1(43.72,14.36) 43.72,14.04 C3.1 42.78,13.07 C4.1 ; X1.2 35.81,27.01 X1.4
  Top Layer w0.254: X1.4 33.2,26 31,26 30.28,26.73 C11.1 ; 30.12,24.66 30.64,24.13 R10.1
  Top Layer w0.508: R1.2 R2.2 ; C11.1 27.39,26.73 26.7,26.04 26.7,24.9 27.06,24.54 30.01,24.54 30.12,24.66
  Bottom Layer w0.203: v1(12.55,13.55) 12.7,13.4 12.7,12.47 13.74,11.43 v1(13.74,10.68) ; v1(24.54,8.01) 25.56,6.99 28.35,6.99 30.63,9.28 v1(30.63,12.07) 31.14,12.58 v1(31.14,13.09) ; v1(19.2,7.76) v1(18.06,6.61) ; v1(15.52,21.85) 15.39,21.73 13.7,21.73 v1(13.53,21.9)
  vias: v1(41.05,8.39) v1(47.91,3.44) v1(48.92,3.44) v1(49.81,6.61) v3(28.91,13.93) v3(54.31,19.01)
VCC: length 124.1
  Top Layer w0.203: v1(55.02,3.56) 55.02,2.93 H2.20 ; R4.1 26.94,24.01 26.63,24.01 26.47,24.18 25.45,24.18 25.28,24.01 v1(25.05,24.01) ; R14.2 20.22,24.9 v1(20.22,23.76) ; Q1.3 45.37,18.18 v2(45.75,18.55) ; 16.98,9.41 17.76,9.41 18.45,8.72 24.97,8.72 v1(25.81,7.88) ; 16.98,9.41 15.73,10.66 14.69,10.66 14.55,10.8 14.55,11.84 U2.38 ; 16.98,9.41 16.98,7.63 ; v1(29.11,16.65) 29.11,20.71 27.97,21.85 ; v1(57.18,4.2) 57.18,7.22 SW1.2
  Top Layer w0.254: SW3.3 49.2,21.04 RN1.1 RN1.2 RN1.3 RN1.4 RN2.1 RN2.2 RN2.3 RN2.4 39.11,23.13 39.11,23.35 38.94,23.52 37.91,23.52 37.89,23.5 37.45,23.5 37.44,23.52 36.4,23.52 36.39,23.5 35.72,23.5 34.47,22.26 v1(33.56,22.26) ; v1(28.48,22.26) 28.07,21.85 R5.1 27.46,21.87 R4.1 ; R11.2 43.92,7.33 43.92,10.5 44.1,10.68 47.91,10.68 48.23,10.36 48.23,9.92
  Top Layer w0.508: RN1.1 46.24,19.94 45.75,19.44 v2(45.75,18.55) ; SW3.3 SW3.6 ; C1.2 48.41,9.47 v2(48.41,8.14) ; SW1.2 v2(58.57,7.25) ; v2(51.59,7.63) 50.38,7.63 48.29,9.72
  Bottom Layer w0.203: v1(20.22,23.76) 21.41,23.76 21.53,23.88 21.96,23.88 22.08,23.76 24.79,23.76 v1(25.05,24.01) ; v1(57.18,4.2) 56.54,3.56 v1(55.02,3.56) ; v1(29.11,16.65) 25.81,13.34 v1(25.81,7.88)
  Bottom Layer w0.254: v1(28.48,22.26) v1(33.56,22.26)
  Bottom Layer w0.508: v2(51.59,7.63) 53.24,9.28 58.07,9.28 58.57,8.77 v2(58.57,7.25) ; v2(45.75,18.55) 49.56,14.74 49.56,9.26 49.2,8.9 49.18,8.9 v2(48.41,8.14)
VCC_SW: length 23.1
  Top Layer w0.254: SW3.5 SW3.2 v1(45.11,24.01) ; Q2.3 v1(37.48,17.53)
  Bottom Layer w0.254: v1(37.48,17.53) 43.96,24.01 v1(45.11,24.01)
VIN_5V: length 42.1
  Top Layer w0.203: Q2.2 38.1,13.9 38.1,11.96 37.95,11.81 36.6,11.81 34.81,13.6 34.81,14.52 U1.5 33.24,14.69 33.24,13.58 32.24,12.58 28.01,12.58 27.01,11.58 C9.1 ; Q2.2 38.43,10.71 Q3.2 ; Q2.2 40.47,14.23 40.56,14.32 40.56,14.74 40.36,14.94 39.73,14.94 38.64,16.04 38.64,17.66 39.4,18.42 41.91,18.42 42.65,17.68 42.65,17.68 42.68,17.66 42.69,17.66 42.82,17.52 44.38,17.52 46.02,15.88 F1.2 48.23,13.87 C2.2 C5.2
P00: length 71.5
  Top Layer w0.254: v1(40.3,23.38) 40.3,22.79 RN2.5 ; U2.37 13.15,11.91 13.15,8.76 v1(13.36,8.54)
  Bottom Layer w0.203: H1.1 3.58,30.72 3.58,21.22 0.79,18.42 0.79,14.61 3.71,11.69 7.65,11.69 10.8,8.54 v1(13.36,8.54)
  Bottom Layer w0.254: v1(40.3,23.38) 36.36,19.44 27.72,19.44 16.83,8.54 v1(13.36,8.54)
P01: length 72.5
  Top Layer w0.254: U2.36 v1(12.61,9.11) 12.61,8.02 v1(12.6,8.01) ; v1(41.05,23.38) 41.05,23 41.69,22.36 RN2.6
  Bottom Layer w0.203: 5.87,30.98 5.87,22.87 1.25,18.25 1.25,14.92 4.09,12.07 8.03,12.07 10.99,9.11 v1(12.61,9.11)
  Bottom Layer w0.254: v1(41.05,23.38) 40.83,23.16 40.83,23.16 40.52,22.84 40.52,22.84 36.22,18.55 27.34,18.55 16.8,8.01 v1(12.6,8.01)
P02: length 74.1
  Top Layer w0.254: RN2.7 42.19,21.9 42.19,22.74 41.81,23.12 v1(41.81,23.38) ; v1(11.84,7.5) v1(11.84,9.78) 11.84,12.16 U2.35
  Bottom Layer w0.203: v1(11.84,9.78) 10.83,9.78 8.16,12.45 4.22,12.45 1.55,15.12 1.55,17.92 8.41,24.77 H1.3
  Bottom Layer w0.254: v1(11.84,7.5) 12.35,7.5 12.38,7.48 16.77,7.48 27.33,18.04 36.48,18.04 v1(41.81,23.38)
P03: length 75.7
  Top Layer w0.254: v1(42.57,23.38) 42.57,22.31 42.62,22.27 42.62,21.97 RN2.8 ; v1(11.08,6.87) v1(11.08,10.65) 11.08,12.12 U2.34
  Bottom Layer w0.203: H1.4 10.95,26.68 1.93,17.66 1.93,15.38 4.22,13.09 8.64,13.09 v1(11.08,10.65)
  Bottom Layer w0.254: v1(42.57,23.38) 42.44,23.38 42.34,23.28 42.34,23.16 36.72,17.53 27.33,17.53 16.66,6.87 v1(11.08,6.87)
P04: length 81.3
  Top Layer w0.203: v1(26.44,6.24) 26.24,6.04 11.19,6.04 10.77,6.46 6.91,6.46 6.58,6.79 v1(6.58,13.85)
  Top Layer w0.254: U2.33 9.22,13.85 v1(6.58,13.85) ; RN1.5 44.08,22.56 v1(44.08,23)
  Bottom Layer w0.203: H1.5 13.49,28.71 2.31,17.53 2.31,15.76 4.22,13.85 v1(6.58,13.85) ; v1(44.08,23) 44.08,22.3 28.15,6.36 26.56,6.36 v1(26.44,6.24)
P05: length 83.9
  Top Layer w0.203: v1(25.05,5.53) 24.86,5.34 6.89,5.34 6,6.23 v1(6,14.69)
  Top Layer w0.254: RN1.6 45.24,22.48 44.86,22.87 v1(44.86,23) ; v1(6,14.69) 9.25,14.69 U2.32
  Bottom Layer w0.203: H1.6 16.03,30.49 2.82,17.28 2.82,16.14 4.27,14.69 v1(6,14.69) ; v1(25.05,5.53) 25.65,5.53 25.85,5.74 27.98,5.74 44.86,22.61 v1(44.86,23)
P06: length 87.7
  Top Layer w0.203: v1(5.36,15.58) 5.36,5.72 6.06,5.03 25.86,5.03 v1(26.06,5.23)
  Top Layer w0.254: RN1.7 v1(45.74,23.12) ; U2.31 9.22,15.58 v1(5.36,15.58)
  Bottom Layer w0.203: v1(26.06,5.23) 26.35,5.23 26.46,5.34 28.12,5.34 45.62,22.84 45.62,23.12 ; H1.7 18.57,29.73 18.06,29.22 15.39,29.22 3.58,17.41 3.58,16.39 4.4,15.58 v1(5.36,15.58)
P07: length 91.7
  Top Layer w0.203: v1(4.73,16.27) 4.73,5.34 5.35,4.72 26.94,4.72 v1(26.95,4.73)
  Top Layer w0.254: v1(4.73,16.27) 9.23,16.27 U2.30 ; v1(46.87,23.48) 46.42,23.03 46.42,22.07 RN1.8
  Bottom Layer w0.203: v1(26.95,4.73) 27.4,4.73 27.5,4.83 28.22,4.83 v1(46.87,23.48) ; v1(4.73,16.27) 7.77,19.31 7.77,20.96 15.65,28.84 20.35,28.84 21.11,29.6 H1.8
P10: length 35.4
  Top Layer w0.203: v1(15.14,14.61) 15.81,13.94 U2.40
  Bottom Layer w0.203: H1.9 23.65,29.47 22.51,28.33 15.9,28.33 8.16,20.58 8.16,16.27 9.81,14.61 v1(15.14,14.61)
P11: length 36.8
  Top Layer w0.203: v1(15.65,15.12) 15.65,14.87 16.61,13.9 U2.41
  Bottom Layer w0.203: v1(15.65,15.12) 9.93,15.12 8.66,16.39 8.66,20.46 16.03,27.82 23.04,27.82 H1.10
P12: length 40.3
  Top Layer w0.203: U2.42 17.41,13.99 16.28,15.12 v1(16.28,15.76)
  Bottom Layer w0.203: H1.11 28.73,29.22 26.82,27.31 16.16,27.31 9.04,20.2 9.04,16.77 10.06,15.76 v1(16.28,15.76)
P13: length 42.1
  Top Layer w0.203: U2.43 18.21,13.62 16.62,15.21 16.62,15.38 16.79,15.55 16.79,15.97 16.62,16.14 v1(16.62,16.35)
  Bottom Layer w0.203: v1(16.62,16.35) 16.2,16.35 16.11,16.27 10.06,16.27 9.35,16.98 9.35,20 16.16,26.81 26.85,26.81 31.02,30.98 31.27,30.98
P14: length 43.2
  Top Layer w0.203: v1(16.16,17.03) 16.28,17.03 16.33,17.07 16.62,17.07 17.43,16.27 17.43,15 19.01,13.41 U2.44
  Bottom Layer w0.203: v1(16.16,17.03) 11.33,17.03 9.93,18.42 9.93,20.02 16.41,26.5 27.03,26.5 30.38,29.85 32.56,29.85 33.68,30.98 H1.13
P15: length 88.2
  Top Layer w0.203: v1(15.9,25.03) 14,26.93 v1(9.68,26.93) ; v1(7.77,9.15) 7.77,11.13 10.37,13.72 10.37,16.95 v1(11.33,17.92) ; H1.14 36.22,30.85 v1(36.22,28.84) ; v1(9.68,29.35) 7.86,29.35 7.73,29.47 7.31,29.47 7.18,29.35 v1(5.23,29.35) ; v1(17.93,15.38) 19.39,13.92 U2.1 ; v1(3.08,21.6) v1(4.98,23.5)
  Bottom Layer w0.203: v1(3.08,21.6) 3.08,21.22 0.41,18.55 0.41,14.49 5.74,9.15 v1(7.77,9.15) ; v1(4.98,23.5) 4.98,29.09 v1(5.23,29.35) ; v1(36.22,28.84) 36.22,26.81 33.94,24.52 16.41,24.52 v1(15.9,25.03) ; v1(17.93,15.38) 17.81,15.5 17.81,16.77 17.05,17.53 11.71,17.53 v1(11.33,17.92) ; v1(9.68,29.35) v1(9.68,26.93)
P16: length 36.3
  Top Layer w0.203: v1(21.75,23.38) 21.49,23.38 21.29,23.17 19.56,23.17 19.48,23.09 19.48,22.83 16.39,19.74 16.39,18.78 16.92,18.25 16.92,17.83 16.66,17.58 16.66,17.54 18.65,15.56 18.65,15.42 19.36,14.72 U2.2 ; v1(38.83,28.9) 38.89,28.97 38.89,30.98
  Bottom Layer w0.203: v1(21.75,23.38) 25.58,23.38 25.89,23.68 33.61,23.68 v1(38.83,28.9)
P17: length 36.8
  Top Layer w0.203: U2.3 19.32,15.52 17.55,17.28 17.55,20.33 20.09,22.87 v1(22.38,22.87) ; v1(41.43,28.33) H1.16
  Bottom Layer w0.203: v1(41.43,28.33) 39.02,28.33 34.06,23.38 26.01,23.38 25.5,22.87 v1(22.38,22.87)
P20: length 36.6
  Top Layer w0.203: v1(43.97,28.08) H1.17 ; v1(14,22.36) 14,23.44 U2.18
  Bottom Layer w0.203: v1(43.97,28.08) 43.72,27.82 39.02,27.82 34.27,23.07 26.14,23.07 25.43,22.36 14,22.36
P21: length 42.1
  Top Layer w0.203: v1(46.51,27.95) H1.18 ; v1(12.87,21.98) 12.87,22.62 13.08,22.83 13.08,23.31 U2.19
  Bottom Layer w0.203: v1(46.51,27.95) 46.35,27.79 46.03,27.79 45.61,27.36 39.07,27.36 34.22,22.51 34.02,22.51 33.77,22.77 28.27,22.77 28.01,22.51 26.15,22.51 24.99,21.35 12.99,21.35 12.87,21.47 v1(12.87,21.98)
P22: length 45.2
  Top Layer w0.203: v1(12.36,21.22) 12.36,23.4 U2.20 ; v1(49.05,27.95) 49.05,30.98
  Bottom Layer w0.203: v1(12.36,21.22) 12.56,21.02 25.15,21.02 25.89,21.75 33.89,21.75 39.19,27.06 47.91,27.06 48.8,27.95 v1(49.05,27.95)
P23: length 48.9
  Top Layer w0.203: v1(11.69,20.96) 11.69,23.52 U2.21 ; v1(51.72,28.08) 51.72,30.85 H1.20
  Bottom Layer w0.203: v1(51.72,28.08) 50.32,26.68 39.27,26.68 34.04,21.45 26.04,21.45 25.56,20.96 25.53,20.96 25.28,20.71 12.15,20.71 11.9,20.96 v1(11.69,20.96)
P24: length 52.8
  Top Layer w0.203: U2.22 11.08,23.59 11.08,20.51 v1(11.26,20.33) ; v1(54.13,28.08) H1.21
  Bottom Layer w0.203: v1(11.26,20.33) 11.28,20.34 25.36,20.34 26.16,21.14 34.17,21.14 39.33,26.31 52.94,26.31 53.88,27.25 53.88,27.88 54.07,28.08 v1(54.13,28.08)
P25: length 58.2
  Top Layer w0.203: H1.22 56.67,28.58 v1(56.03,27.95) ; U2.23 10.63,21.92 10.7,21.85 v1(10.7,18.55)
  Bottom Layer w0.203: v1(10.7,18.55) 10.75,18.5 13.2,18.5 13.67,18.97 24.42,18.97 26.24,20.79 34.66,20.79 39,25.13 39.63,25.13 39.83,25.34 47.61,25.34 47.66,25.28 54.89,25.28 55.04,25.43 55.04,26.19 56.03,27.19 v1(56.03,27.95)
P26: length 41.4
  Top Layer w0.203: v1(7.52,28.97) 6.76,28.97 2.69,24.9 2.19,24.35 2.19,3.95 4.09,2.04 5.87,2.04 ; U2.24 8.13,21.12 7.77,21.47 v1(7.77,25.54)
  Bottom Layer w0.203: v1(7.77,25.54) 7.77,28.71 v1(7.52,28.97)
P27: length 41.7
  Top Layer w0.203: U2.25 7.79,20.32 7.01,21.09 v1(7.01,24.65) ; H2.2 7.83,2.04 6.77,3.09 3.8,3.09 2.57,4.33 2.57,23.76 v1(6.76,27.95)
  Bottom Layer w0.203: v1(6.76,27.95) 7.01,27.7 v1(7.01,24.65)
P30: length 46
  Top Layer w0.203: v1(11.59,19.31) 11.59,18.38 11.84,18.13 11.84,17.59 11.59,17.33 11.59,14.46 10.11,12.99 10.11,9.71 v1(8.66,8.26) ; LED1.2 25.95,17.26 26.11,17.11 26.11,12.66 25.02,11.57 25.02,11.41 24.69,11.08 24.23,11.08 23.9,11.41 23.9,11.74 23.17,12.48 23.17,14.38 D1.2 22.63,15.23 21.84,16.03 21.84,16.51 21.57,16.78 21.09,16.78 U2.5 20.56,17.3 19.51,17.3 18.19,18.62 18.19,19.69
  Bottom Layer w0.203: v1(8.66,8.26) 8.66,4.33 H2.3 ; v1(18.19,19.82) 12.09,19.82 v1(11.59,19.31)
P31: length 40.7
  Top Layer w0.203: 25.64,19.83 24.54,20.93 24.54,24.8 Q4.2 ; 25.64,19.83 LED2.2 ; 25.64,19.83 25.51,19.7 v1(24.19,19.7) ; U2.7 20.41,19.05 19.93,19.05 19.47,19.52 v1(19.08,19.52) ; v1(10.4,8.22) 10.75,8.57 10.75,9.94 10.41,10.27 10.41,11.66 10.55,11.8 10.55,13 10.82,13.27 11.2,13.27 11.94,14.01 11.94,14.74 11.94,14.74 11.94,16.95 12.47,17.48 v1(12.47,19.14)
  Bottom Layer w0.203: H2.4 10.4,5.13 v1(10.4,8.22) ; v1(24.19,19.7) 24,19.52 v1(19.08,19.52) 18.84,19.27 12.61,19.27 v1(12.47,19.14)
P32: length 24.1
  Top Layer w0.203: U2.8 21.94,19.52 22.14,19.31 22.14,16.71 23.73,15.13 v3(23.73,12.71)
  Bottom Layer w0.203: v3(23.73,12.71) 23.73,12.33 22.66,11.26 22.66,6.13 19.71,3.18 17.17,3.18 H2.5
P33: length 23.4
  Top Layer w0.203: U2.9 22.32,20.32 22.52,20.11 22.52,16.76 24.03,15.25 24.03,13.6 v3(24.28,13.34)
  Bottom Layer w0.203: H2.6 19.2,2.04 22.96,5.8 22.96,10.94 24.28,12.26 v3(24.28,13.34)
P34: length 23.6
  Top Layer w0.203: v3(24.46,11.64) 24.21,11.9 24.21,12.4 24.28,12.48 24.28,12.55 24.84,13.11 24.84,13.58 24.52,13.9 24.52,15.2 22.82,16.89 22.82,20.24 22.57,20.49 22.57,20.79 22.37,20.99 20.88,20.99 U2.10
  Bottom Layer w0.203: H2.7 21.49,2.04 23.27,3.82 23.27,10.45 v3(24.46,11.64)
P35: length 23.2
  Top Layer w0.203: v3(25.11,12.45) 25.01,12.56 25.01,12.85 25.15,12.99 25.15,13.75 24.82,14.08 24.82,15.33 23.13,17.02 23.13,20.37 23.03,20.47 23.03,20.95 22.17,21.81 20.85,21.81 U2.11
  Bottom Layer w0.203: H2.8 23.65,10.04 25.11,11.5 v3(25.11,12.45)
P36: length 37.9
  Top Layer w0.203: v1(14.25,9.41) 15.33,8.33 16.09,8.33 16.33,8.09 16.33,7.07 16.48,6.93 17.49,6.93 17.81,7.25 24.03,7.25 v1(24.16,7.12) ; U2.12 19.01,22.8 16.08,19.87 16.08,18.37 v1(16.41,18.04) ; v1(13.21,13.6) 13.21,14.33 12.55,15 12.55,16.7 13.47,17.61 v1(13.47,18.04)
  Bottom Layer w0.203: v1(13.21,13.6) 13.21,12.4 14.51,11.1 14.51,9.66 v1(14.25,9.41) ; v1(24.16,7.12) 24.16,4.07 H2.9 ; v1(16.41,18.04) 16.24,18.04 15.73,18.55 13.91,18.55 13.62,18.25 13.62,18.2 v1(13.47,18.04)
P37: length 35.6
  Top Layer w0.203: v1(14.13,18.04) 14.13,17.84 12.85,16.57 12.85,15.12 13.87,14.11 v1(13.87,13.98) ; U2.13 17.88,23.31 17.88,22.83 15.78,20.73 15.78,18.42 v1(15.39,18.04) ; v1(27.71,4.33) 27.71,7.72 26.1,9.33 19.15,9.33 v1(17.55,10.93)
  Bottom Layer w0.203: v1(15.39,18.04) v1(14.13,18.04) ; H2.10 28.73,3.31 v1(27.71,4.33) ; v1(17.55,10.93) 15.01,13.47 14.38,13.47 v1(13.87,13.98)
P40: length 33.6
  Top Layer w0.203: U2.17 14.68,23.31 14.68,17.96 14.63,17.92 14.63,14.82 14.63,14.82 14.63,14.4 14.63,14.4 v1(14.63,14.1) ; v1(18.58,11.05) 19.97,9.66 26.2,9.66 28.22,7.64 28.22,4.58 v1(28.48,4.33)
  Bottom Layer w0.203: 31.27,2.04 31.27,2.8 29.87,4.2 28.6,4.2 v1(28.48,4.33) ; v1(18.58,11.05) 15.52,14.1 v1(14.63,14.1)
P41: length 50.1
  Top Layer w0.203: U2.28 4.27,17.92 3.58,17.23 3.58,4.71 4.59,3.7 32.65,3.7 33.81,2.55 H2.12
P42: length 30.7
  Top Layer w0.203: H2.13 36.35,3.31 35.49,4.17 31.17,4.17 29.24,6.11 v1(29.24,10.17) ; U2.39 15.35,11.84 15.35,11.36 15.62,11.09 16.1,11.09 17.08,10.11 17.49,10.11 18.57,9.03 25.69,9.03 v1(26.64,8.08)
  Bottom Layer w0.203: v1(29.24,10.17) 28.08,9.01 27.57,9.01 v1(26.64,8.08)
P43: length 35.4
  Top Layer w0.203: v1(29.24,4.71) 29.24,4.83 28.62,5.45 28.62,7.67 26.33,9.97 20.68,9.97 19.63,11.01 v1(19.63,12.37) ; v1(38.89,3.95) 38.89,2.04 ; U2.6 19.71,17.92 19.22,18.41 v3(19.19,18.41)
  Bottom Layer w0.203: v1(19.63,12.37) 18.44,13.56 18.44,17.15 19.19,17.9 v3(19.19,18.41) ; v1(38.89,3.95) 38.13,4.71 v1(29.24,4.71)
P44: length 108.2
  Top Layer w0.203: v1(31.27,29.35) 30.63,28.71 8.66,28.71 5.87,25.92 5.87,20.33 6.68,19.52 U2.26 ; v1(58.7,28.33) 58.57,28.2 58.57,8.64 58.11,8.18 56.48,8.18 56.34,8.03 56.34,6.2 56.03,5.9 56.03,1.53 55.89,1.39 54.97,1.39 54.57,0.99 43.53,0.99 43.13,1.39 42.72,1.39 42.06,2.04 H2.15
  Bottom Layer w0.203: v1(31.27,29.35) 38.55,29.35 38.62,29.41 39.04,29.41 39.1,29.35 57.69,29.35 v1(58.7,28.33)
P45: length 63.9
  Top Layer w0.203: U2.27 4.51,18.72 3.08,17.28 3.08,4.58 4.26,3.4 32.07,3.4 v1(32.54,2.93) ; v1(44.03,3.82) 44.03,2.1 H2.16 43.97,1.55
  Bottom Layer w0.203: H2.16 43.08,2.93 42.03,2.93 41.87,3.09 33.37,3.09 33.21,2.93 v1(32.54,2.93)
P46: length 64.7
  Top Layer w0.203: v1(46.51,3.82) H2.17 ; U2.29 4.44,17.12 3.96,16.65 3.96,5.09 5.04,4.01 25.99,4.01 v1(26.19,4.21)
  Bottom Layer w0.203: v1(26.19,4.21) 27.46,2.94 27.46,1.28 27.84,0.9 45.37,0.9 H2.17
RST: length 61.9
  Top Layer w0.508: SW1.1 51.18,5.6 47.4,5.6 46.77,6.22 46.77,9.73 46.83,9.79 v2(44.6,9.79) ; U2.4 19.26,16.32 v1(19.25,16.31)
  Bottom Layer w0.508: v1(19.25,16.31) 21.45,18.51 24.61,18.51 26.43,20.33 34.85,20.33 39.19,24.67 47.17,24.67 47.53,24.31 47.53,22.61 44.6,19.69 v2(44.6,9.79)
RTS: length 3.4
  Top Layer w0.508: U1.4 33.95,10.03 35.08,8.9 R12.1
USB_D+: length 45.5
  Top Layer w0.254: USB1.6 51.71,14.87 51.46,15.12 51.46,15.63 51.7,15.87 USB1.8 53.32,15.87 53.37,15.83 53.79,15.83 55.15,14.47 55.15,4.92 54.73,4.5 31.47,4.5 30.13,5.85 U1.1
USB_D-: length 45.7
  Top Layer w0.254: U1.2 31.4,9.15 32.47,8.08 34.12,8.08 34.44,7.76 34.44,6.23 34.19,5.98 32.92,5.98 32.29,5.34 32.29,4.91 54.56,4.91 54.74,5.09 54.74,14.3 53.62,15.42 53.37,15.42 53.32,15.37 ; USB1.7 53.32,15.37 ; 53.32,15.37 53.37,15.37 53.75,15 53.75,14.61 53.51,14.37 USB1.5
XTAL1: length 27.6
  Top Layer w0.508: 31.97,28.01 31.52,27.56 C11.2 ; 31.97,28.01 32.01,27.97 32.73,27.97 33.24,28.48 34.42,28.48 34.83,28.08 38.1,28.08 38.21,27.97 X1.3 ; 31.97,28.01 18.89,28.01 16.61,25.74 16.61,23.52
XTAL2: length 18.4
  Top Layer w0.508: v2(27.84,25.37) 29.54,25.37 29.55,25.38 30.69,25.38 30.7,25.37 30.8,25.37 31.52,24.65 C12.2 34.12,24.53 X1.1 ; U2.14 17.41,24.35 18.42,25.36 v2(18.66,25.36)
  Bottom Layer w0.508: v2(27.84,25.37) 18.67,25.37 v2(18.66,25.36)
$1N493: length 5.3
  Top Layer w0.254: USB1.10 51.71,16.87 51.7,16.86 51.16,16.86 50.77,17.25 50.77,18.86 50.07,19.57 R1.1
$1N513: length 6.2
  Top Layer w0.254: R2.1 49.56,17.92 50.32,17.15 50.32,16.52 50.95,15.88 50.95,14.23 51.32,13.87 USB1.4
$1N622: length 10.9
  Top Layer w0.508: USB1.2 51.37,12.72 v2(50.95,13.14) 49.1,15 F1.1 ; v2(51.43,17.52) USB1.11
  Bottom Layer w0.508: v2(51.43,17.52) 51.43,13.62 v2(50.95,13.14)
$1N5316: length 2.6
  Top Layer w0.254: R11.1 39.11,6.49 LED3.1
$1N5569: length 4.5
  Top Layer w0.508: 26.75,13.57 26.75,14.15 27.46,14.87 29.24,14.87 29.62,15.25 29.98,15.25 U1.8
$1N5583: length 20.9
  Top Layer w0.203: v1(25.43,14.74) 25.13,15.04 25.13,15.45 23.65,16.93 Q4.3 ; v1(30.38,16.77) 31.4,15.76 U1.7
  Bottom Layer w0.203: v1(25.43,14.74) 26.49,14.74 28.9,17.15 30,17.15 v1(30.38,16.77)
$1N5587: length 14.1
  Top Layer w0.203: U1.6 32.54,15.26 v1(32.54,13.6) ; v1(27.59,9.92) 26.78,10.73 24.16,10.73 23.36,11.52 D1.1
  Bottom Layer w0.203: v1(27.59,9.92) 30.55,12.88 30.55,13.22 30.93,13.6 v1(32.54,13.6)
$1N5943: length 8.3
  Top Layer w0.254: LED1.1 27.76,18.24 28.53,19.01 28.53,20.64 28.36,20.8 28.1,20.8 27.76,21.14 26.93,21.14 26.77,21.31 26.77,22.68 R4.2
$1N5953: length 2.8
  Top Layer w0.254: R5.2 25.94,21.62 LED2.1
$1N7938: length 2.6
  Top Layer w0.508: Q3.1 36.58,10.69 R12.2
$1N8027: length 13
  Top Layer w0.508: R6.2 38.42,21.2 C10.2 38.32,19.7 35.27,16.65 35.27,13.79 36.22,12.84 37.35,12.84 Q3.3
$1N8039: length 7
  Top Layer w0.254: R6.1 36.92,21.09 C10.1 35.77,19.94 R13.1 32.29,19.94 R10.2
$1N8088: length 8.4
  Top Layer w0.254: Q2.1 v3(36.53,16.39) ; v3(34.44,16.77) R13.2 34.31,18.3 R8.2
  Bottom Layer w0.254: v3(34.44,16.77) 34.83,16.39 v3(36.53,16.39)
$1N12588: length 3.1
  Top Layer w0.203: Q4.1 21.13,26.43 R14.1

## Copper pours and planes (outline as drawn; the poured copper is in the pictures)
GND on Top Layer: -1.75,34.55 62.51,34.55 62.51,-1.77 -1.75,-1.77
GND on Bottom Layer: -1.75,34.17 62,34.17 62,-2.78 -1.75,-2.78

Small or netless copper shapes (teardrops, artwork), in the pictures only: 296 on Top Layer, 109 on Bottom Layer

## Text on the board
Bottom Silkscreen Layer: P00 | P26 | P01 | P27 | P02 | P30 | P03 | P31 | P04 | P32 | P05 | P33 | P06 | P34 | P07 | P35 | P10 | P36 | P11 | P37 | P12 | P40 | P13 | P41 | P14 | P42 | P15 | P43 | P16 | P44 | P17 | P45 | P20 | P46 | P21 | GND | P22 | 3V3 | P23 | VCC | P24 | P25
Top Silkscreen Layer: P00 | P26 | P01 | P27 | P02 | P30 | P03 | P31 | P04 | P32 | P05 | P33 | P06 | P34 | P07 | P35 | P10 | P36 | P11 | P37 | P12 | P40 | P13 | P41 | P14 | P42 | P15 | P43 | P16 | P44 | P17 | P45 | P20 | P46 | P21 | GND | P22 | 3V3 | P23 | VCC | P24 | P25
